# Altium project Q23_BRAKE_LIGHT.PrjPcb
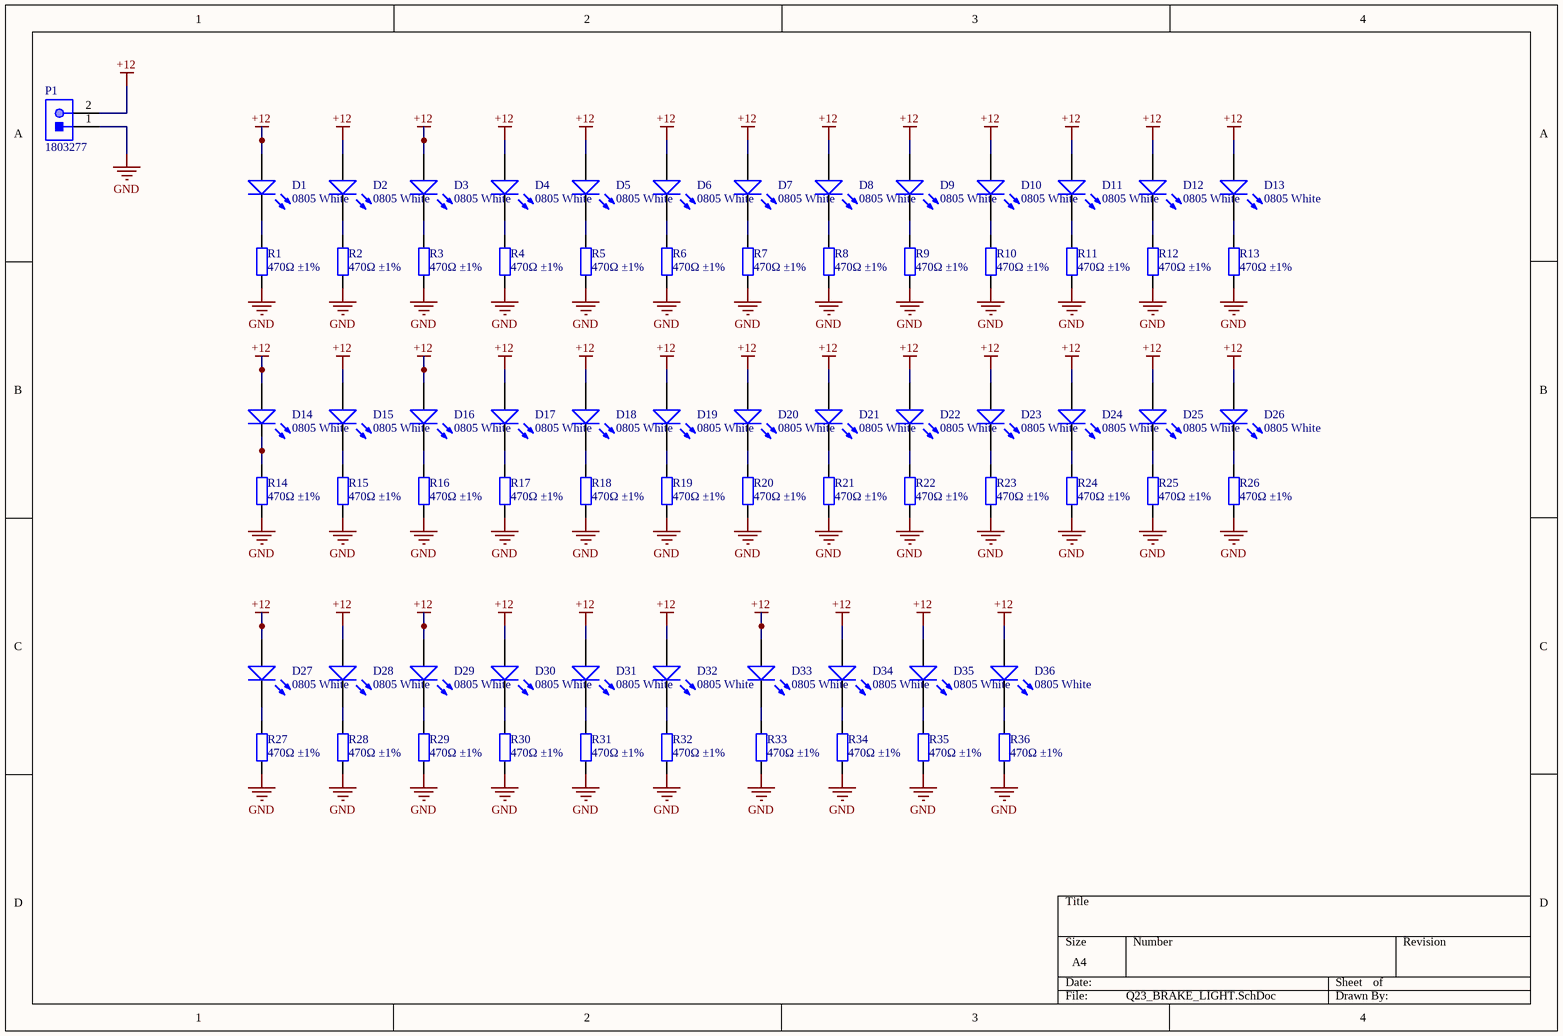
[diagram p0: Q23_BRAKE_LIGHT.SchDoc]
1 sheet, 73 parts. Net scope: global (net labels, ports and power ports of the same name join across sheets).
Board file: Q23_BRAKE_LIGHT.PcbDoc

## Sheet Q23_BRAKE_LIGHT.SchDoc
size A4; SheetNumber: 1; SheetTotal: 1

### Parts
D1  0805 White  [0805_LED_S1]
D2  0805 White  [0805_LED_S1]
D3  0805 White  [0805_LED_S1]
D4  0805 White  [0805_LED_S1]
D5  0805 White  [0805_LED_S1]
D6  0805 White  [0805_LED_S1]
D7  0805 White  [0805_LED_S1]
D8  0805 White  [0805_LED_S1]
D9  0805 White  [0805_LED_S1]
D10  0805 White  [0805_LED_S1]
D11  0805 White  [0805_LED_S1]
D12  0805 White  [0805_LED_S1]
D13  0805 White  [0805_LED_S1]
D14  0805 White  [0805_LED_S1]
D15  0805 White  [0805_LED_S1]
D16  0805 White  [0805_LED_S1]
D17  0805 White  [0805_LED_S1]
D18  0805 White  [0805_LED_S1]
D19  0805 White  [0805_LED_S1]
D20  0805 White  [0805_LED_S1]
D21  0805 White  [0805_LED_S1]
D22  0805 White  [0805_LED_S1]
D23  0805 White  [0805_LED_S1]
D24  0805 White  [0805_LED_S1]
D25  0805 White  [0805_LED_S1]
D26  0805 White  [0805_LED_S1]
D27  0805 White  [0805_LED_S1]
D28  0805 White  [0805_LED_S1]
D29  0805 White  [0805_LED_S1]
D30  0805 White  [0805_LED_S1]
D31  0805 White  [0805_LED_S1]
D32  0805 White  [0805_LED_S1]
D33  0805 White  [0805_LED_S1]
D34  0805 White  [0805_LED_S1]
D35  0805 White  [0805_LED_S1]
D36  0805 White  [0805_LED_S1]
P1  1803277  [PHOE-1803277_V]
R1  470Ω ±1%  [0402_R]
R2  470Ω ±1%  [0402_R]
R3  470Ω ±1%  [0402_R]
R4  470Ω ±1%  [0402_R]
R5  470Ω ±1%  [0402_R]
R6  470Ω ±1%  [0402_R]
R7  470Ω ±1%  [0402_R]
R8  470Ω ±1%  [0402_R]
R9  470Ω ±1%  [0402_R]
R10  470Ω ±1%  [0402_R]
R11  470Ω ±1%  [0402_R]
R12  470Ω ±1%  [0402_R]
R13  470Ω ±1%  [0402_R]
R14  470Ω ±1%  [0402_R]
R15  470Ω ±1%  [0402_R]
R16  470Ω ±1%  [0402_R]
R17  470Ω ±1%  [0402_R]
R18  470Ω ±1%  [0402_R]
R19  470Ω ±1%  [0402_R]
R20  470Ω ±1%  [0402_R]
R21  470Ω ±1%  [0402_R]
R22  470Ω ±1%  [0402_R]
R23  470Ω ±1%  [0402_R]
R24  470Ω ±1%  [0402_R]
R25  470Ω ±1%  [0402_R]
R26  470Ω ±1%  [0402_R]
R27  470Ω ±1%  [0402_R]
R28  470Ω ±1%  [0402_R]
R29  470Ω ±1%  [0402_R]
R30  470Ω ±1%  [0402_R]
R31  470Ω ±1%  [0402_R]
R32  470Ω ±1%  [0402_R]
R33  470Ω ±1%  [0402_R]
R34  470Ω ±1%  [0402_R]
R35  470Ω ±1%  [0402_R]
R36  470Ω ±1%  [0402_R]

### Nets
+12: D1.A D2.A D3.A D4.A D5.A D6.A D7.A D8.A D9.A D10.A D11.A D12.A D13.A D14.A D15.A D16.A D17.A D18.A D19.A D20.A D21.A D22.A D23.A D24.A D25.A D26.A D27.A D28.A D29.A D30.A D31.A D32.A D33.A D34.A D35.A D36.A P1.2
GND: P1.1 R1.1 R2.1 R3.1 R4.1 R5.1 R6.1 R7.1 R8.1 R9.1 R10.1 R11.1 R12.1 R13.1 R14.1 R15.1 R16.1 R17.1 R18.1 R19.1 R20.1 R21.1 R22.1 R23.1 R24.1 R25.1 R26.1 R27.1 R28.1 R29.1 R30.1 R31.1 R32.1 R33.1 R34.1 R35.1 R36.1
NetD1_K: D1.K R1.2
NetD2_K: D2.K R2.2
NetD3_K: D3.K R3.2
NetD4_K: D4.K R4.2
NetD5_K: D5.K R5.2
NetD6_K: D6.K R6.2
NetD7_K: D7.K R7.2
NetD8_K: D8.K R8.2
NetD9_K: D9.K R9.2
NetD10_K: D10.K R10.2
NetD11_K: D11.K R11.2
NetD12_K: D12.K R12.2
NetD13_K: D13.K R13.2
NetD14_K: D14.K R14.2
NetD15_K: D15.K R15.2
NetD16_K: D16.K R16.2
NetD17_K: D17.K R17.2
NetD18_K: D18.K R18.2
NetD19_K: D19.K R19.2
NetD20_K: D20.K R20.2
NetD21_K: D21.K R21.2
NetD22_K: D22.K R22.2
NetD23_K: D23.K R23.2
NetD24_K: D24.K R24.2
NetD25_K: D25.K R25.2
NetD26_K: D26.K R26.2
NetD27_K: D27.K R27.2
NetD28_K: D28.K R28.2
NetD29_K: D29.K R29.2
NetD30_K: D30.K R30.2
NetD31_K: D31.K R31.2
NetD32_K: D32.K R32.2
NetD33_K: D33.K R33.2
NetD34_K: D34.K R34.2
NetD35_K: D35.K R35.2
NetD36_K: D36.K R36.2

### Library data of the parts
D1-D36 = 0805 LED White: LED; ComponentLink1Description: 供应商链接; ComponentLink1URL: http://www.szlcsc.com/product/details_35468.html; Package: 0805; Supplier: LC; SuppliersPartNumber: C34499; Color: White
P1 = CMP-002-00014-2: Male Header, Pitch 3.81 mm, 1 x 2 Position, Height 7.25 mm, Tail Length 3.4 mm, RoHS, Bulk; Manufacturer: Phoenix Contact; Voltage Rating: 160V; Current Rating: 8A; Rows: 1; Mounting Technology: TH; Contact Plating: Tin; Case/Package: 1803277; Gender: Male; Diameter: 7.25mm; Datasheet Version: Feb-14; Colour: Green; Pins: 2; Lead Pitch: 0.15inch; Connector Type: Header; Package Quantity: 50; Max Current Rating: 8A; Manufacturer URL: http://www.phoenixcontact.com/; Packaging: Bulk; RoHS Compliant: True; Datasheet URL: https://datasheet.ciiva.com/16096/1803277-16096845.pdf; Package Reference: 1803277; Package Description: Male Header, Pitch 3.81 mm, 1 x 2 Position, Height 7.25 mm, Tail Length 3.4 mm
R1-R36 = 0402 470R (4700) 1%: Chip resistor; Manufacturer: Uniroyal Elec; PartNumber: 0402WGF4700TCE; Power: 1/16W; ComponentLink1Description: Supplier link; ComponentLink1URL: http://www.szlcsc.com/product/details_25860.html; Package: 0402; Supplier: LC; SuppliersPartNumber: C25117; Resistance: 470Ω; Tolerance: 1%